# EasyEDA schematic Controlador Aforo.json

## Sheets
1 Controlador_aforo: TITLE: Sheet_1; REV: 1.0; Date: 2021-12-02; Sheet: 1/1; Drawn By: Sergio Camilo Reina Cardenas; Company: Your Company
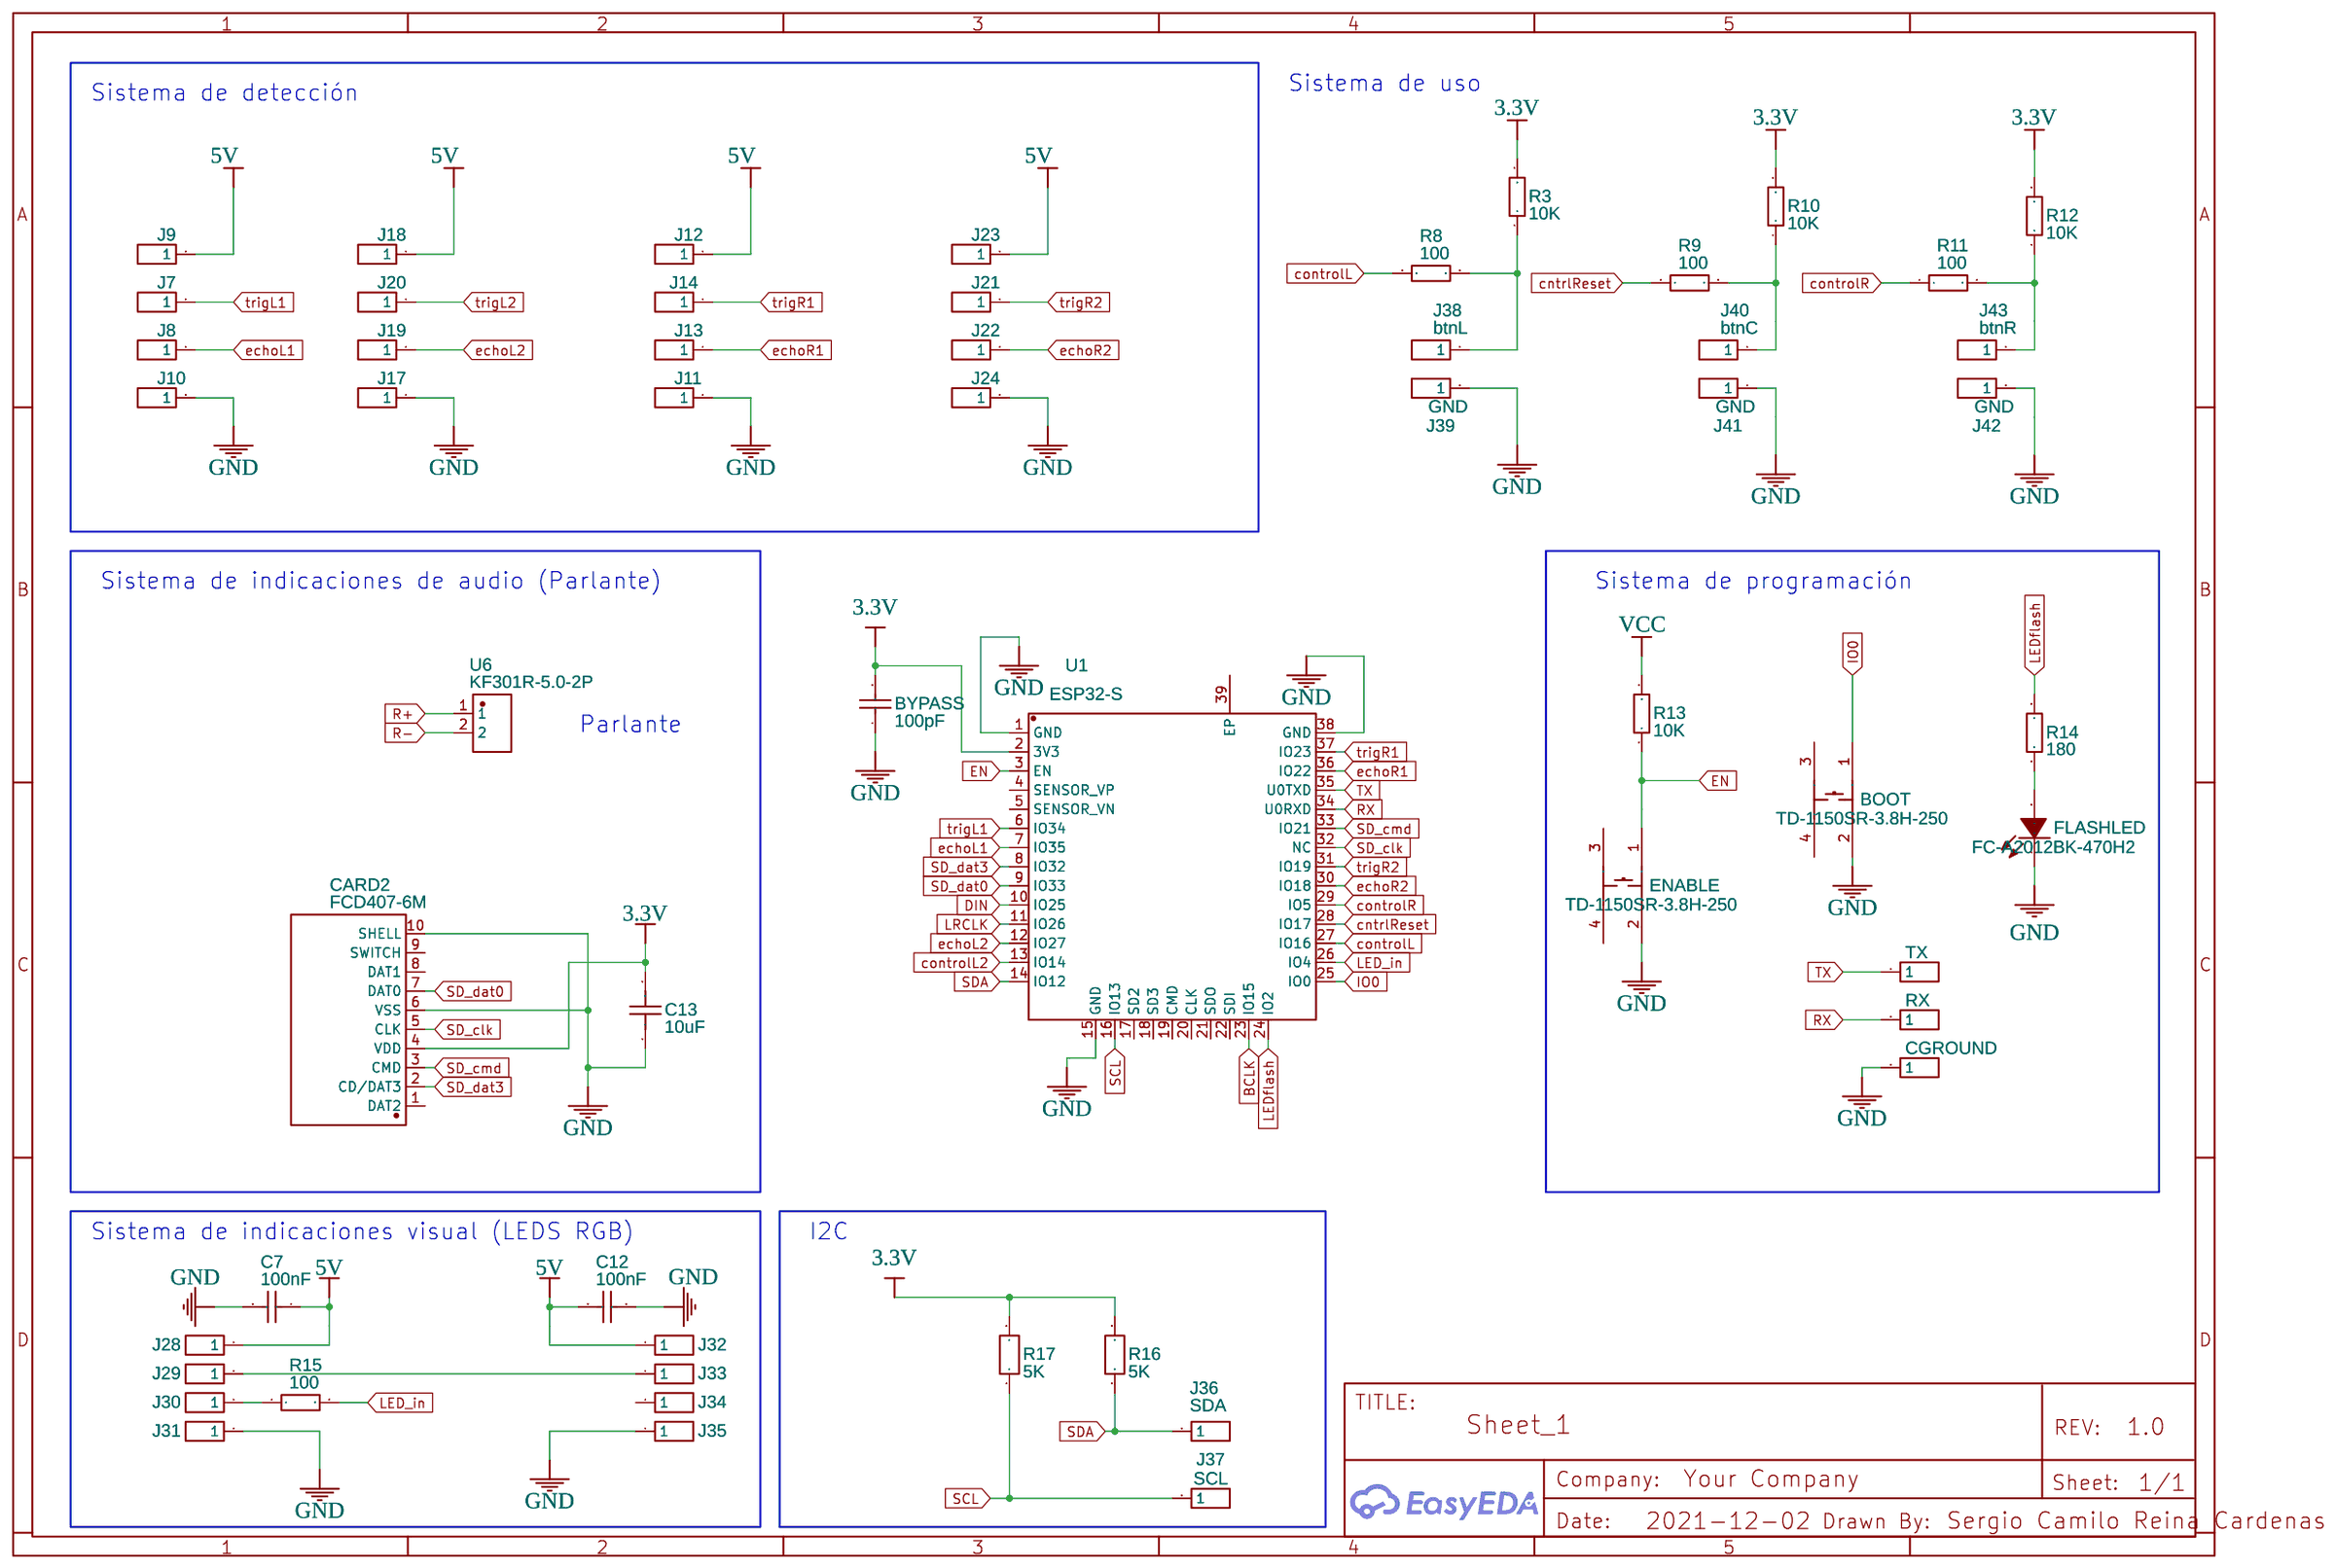
[diagram p0: Controlador_aforo]
2 Power: TITLE: Sheet_2
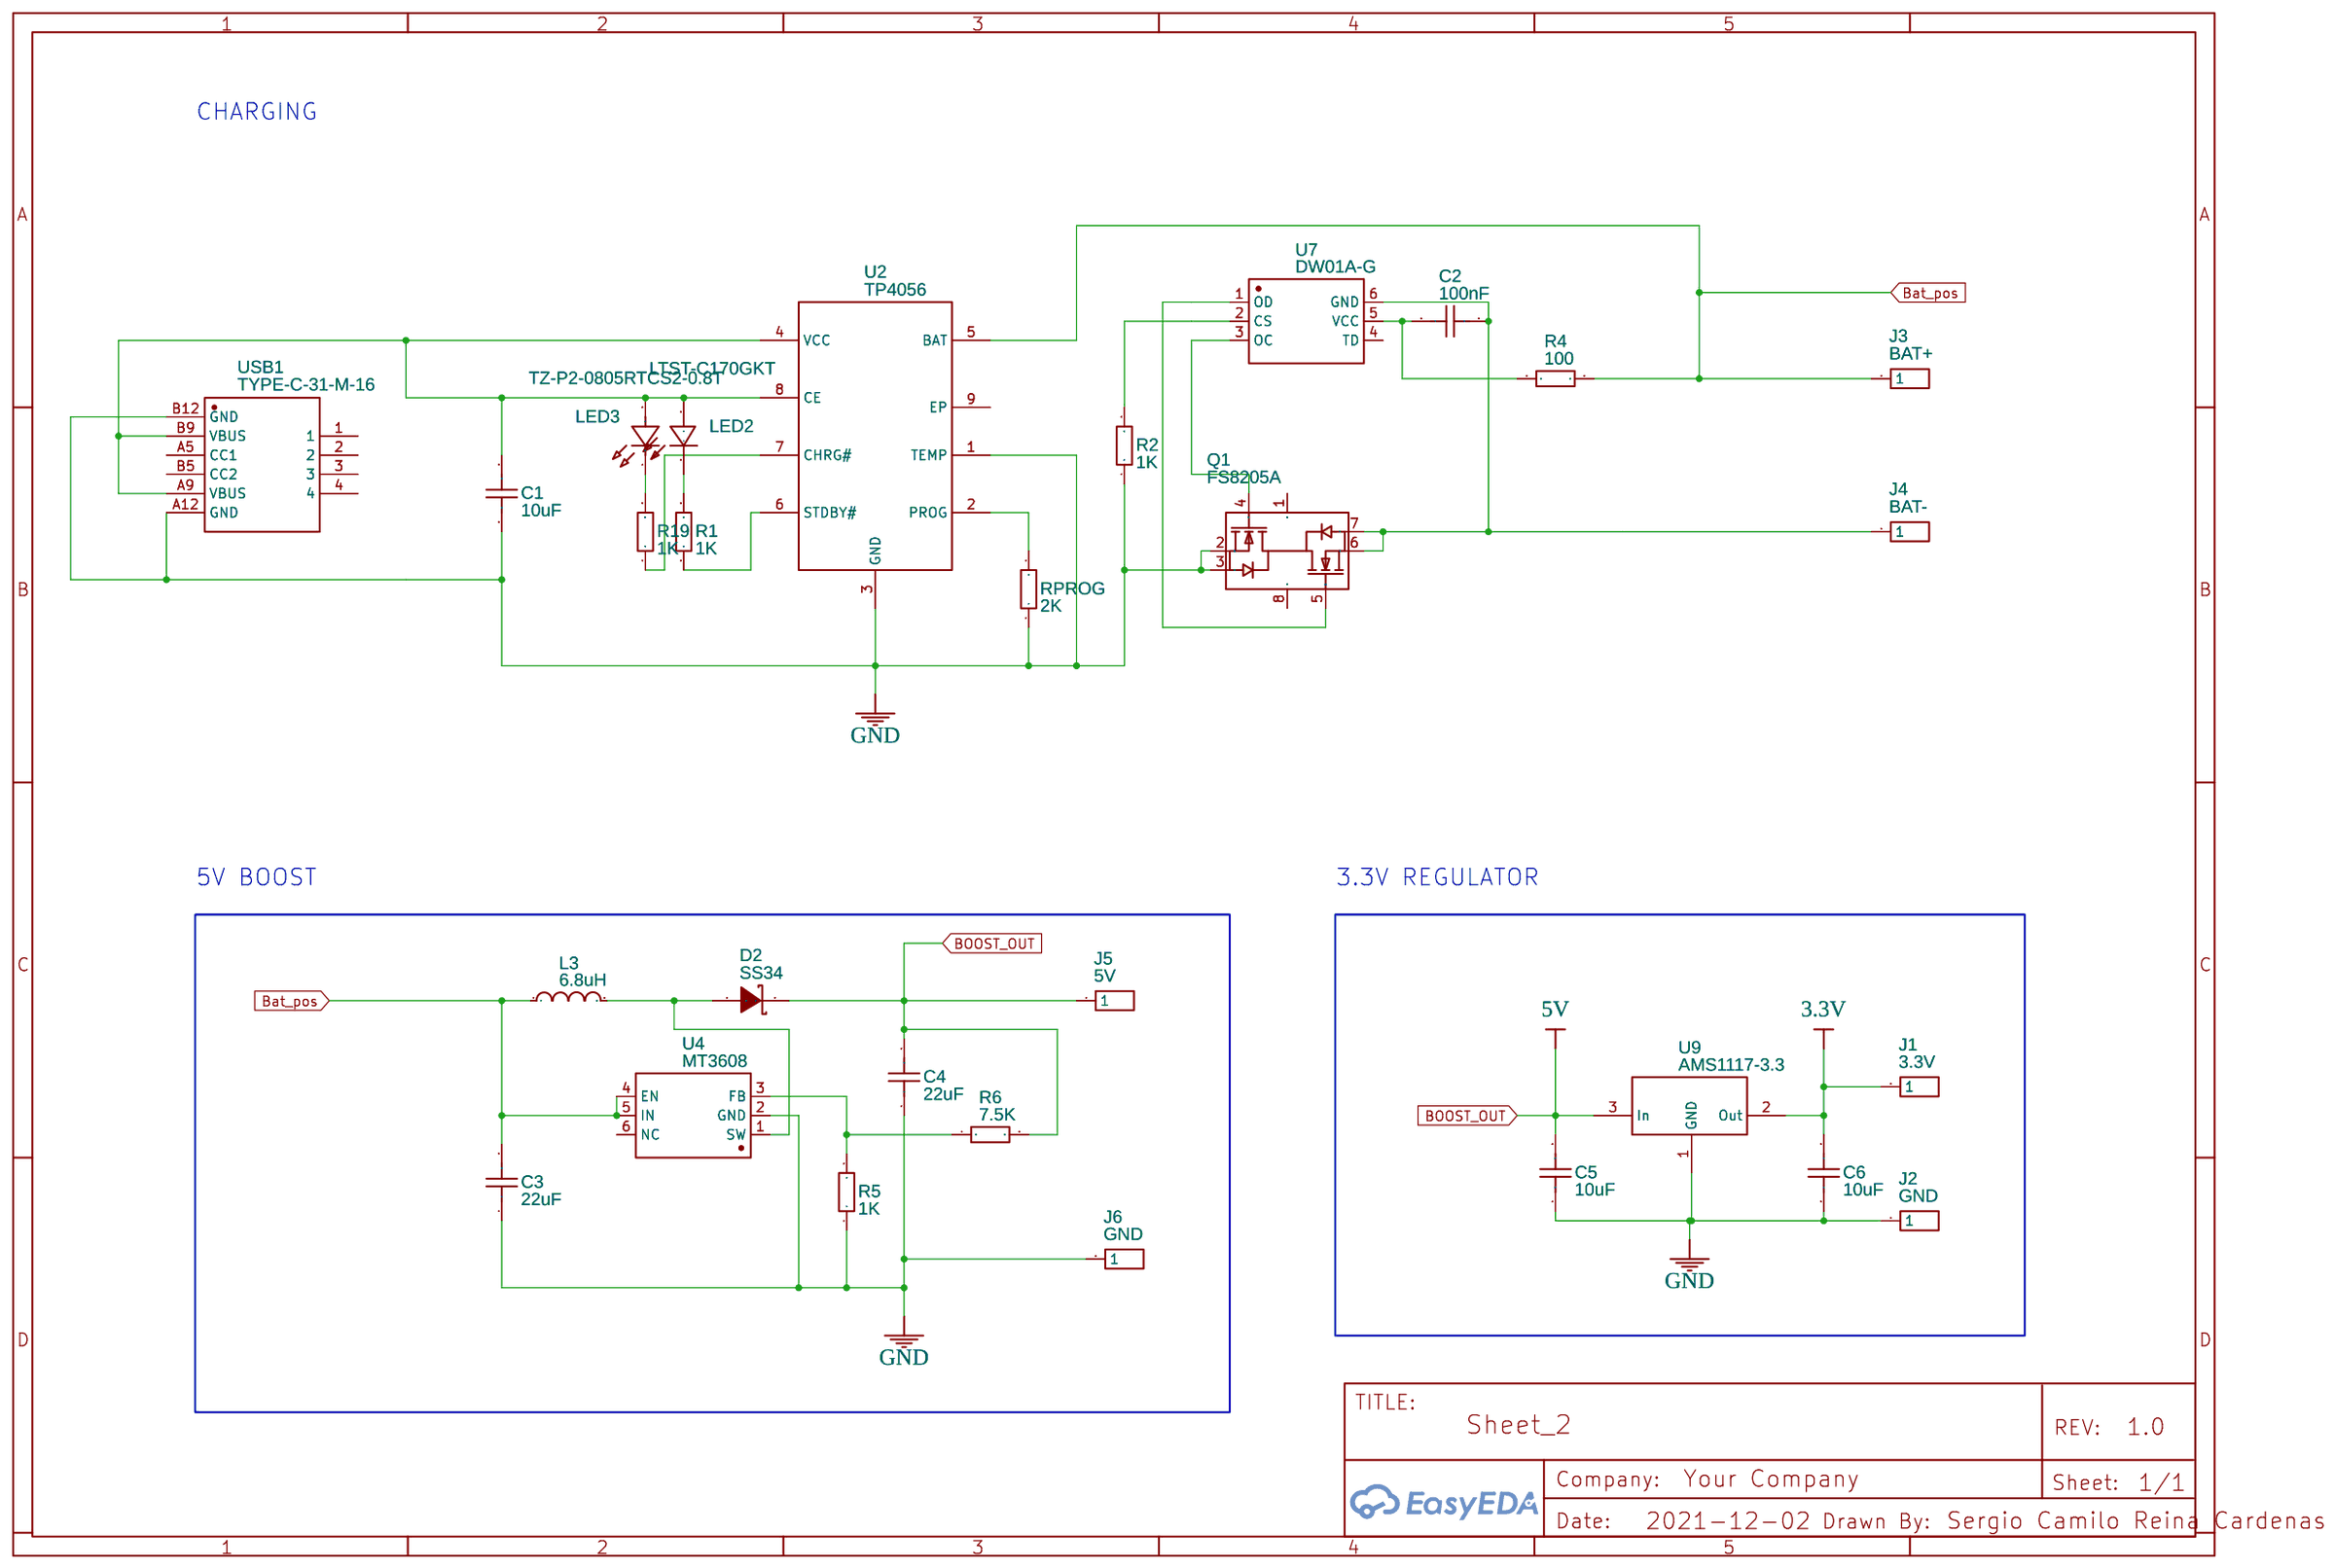
[diagram p1: Power]
3 Audio_amplifier: Date: 2021-12-14
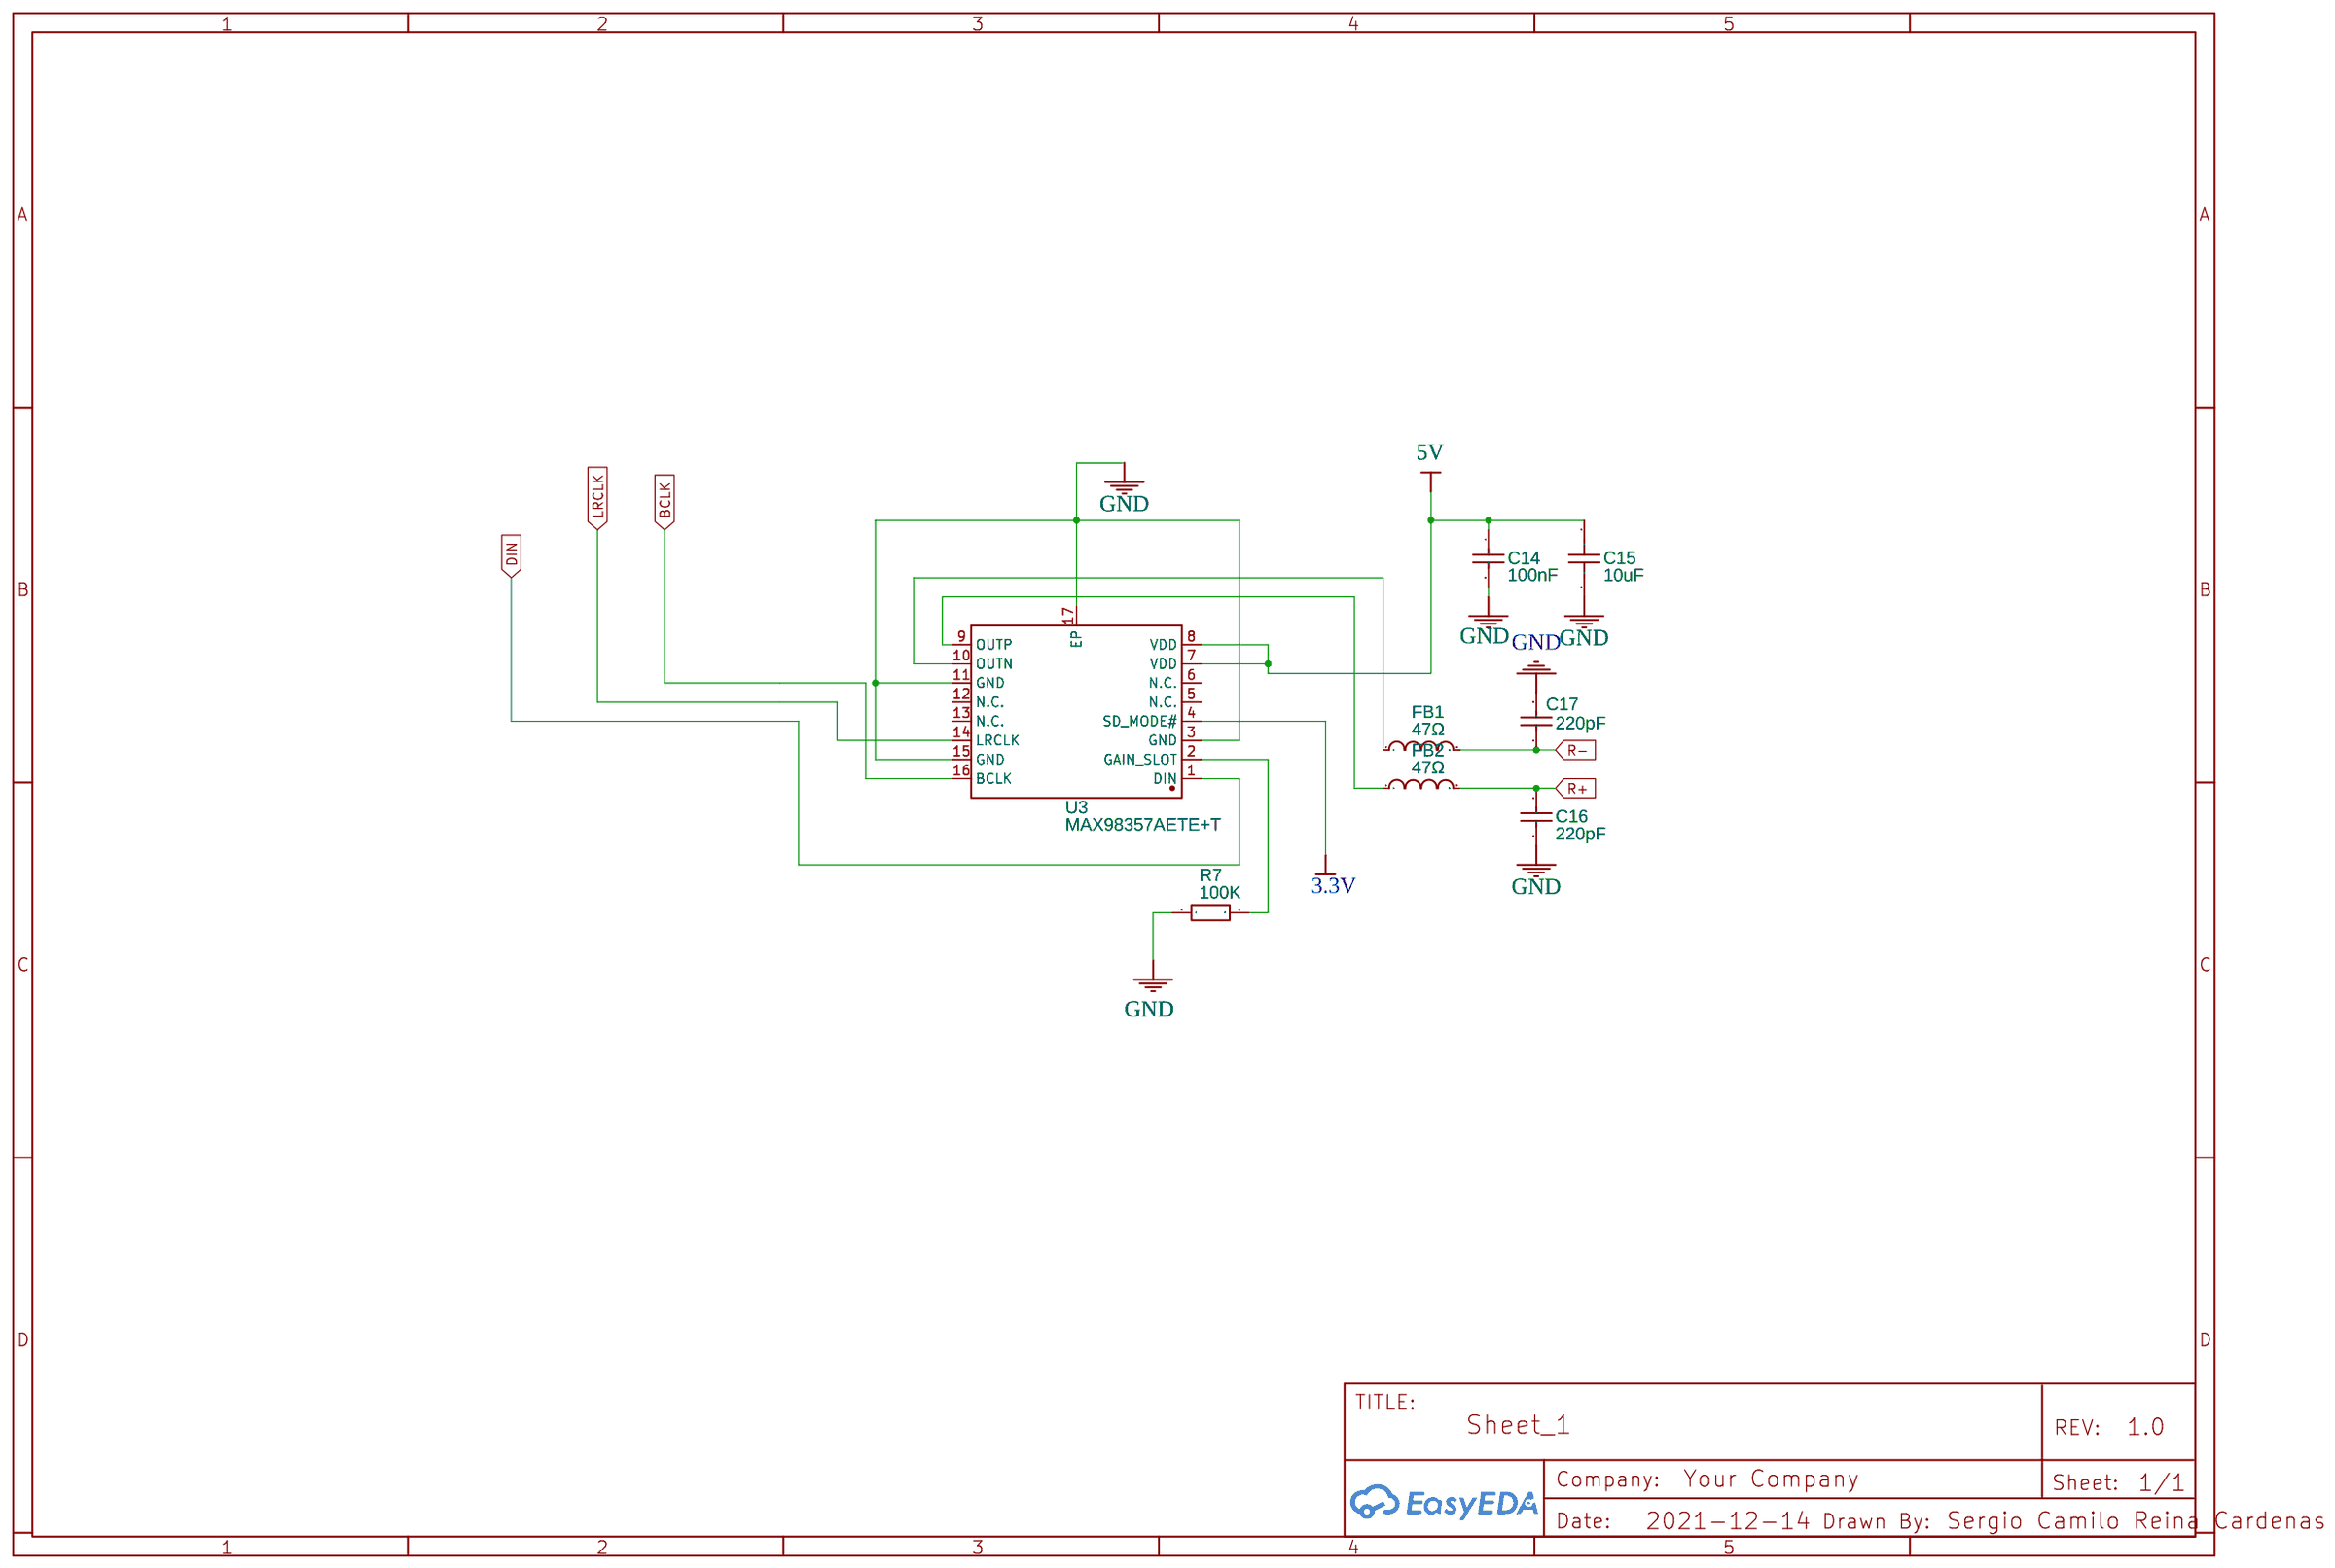
[diagram p2: Audio_amplifier]

## Parts
sheet Audio_amplifier
C14  100nF  [C1210]
C15  10uF  [C0805]
C16  220pF  [0805]
C17  220pF  [0805]
FB1  47Ω  [0805]
FB2  47Ω  [0805]
R7  100K  [R0805]
U3  MAX98357AETE+T  [TQFN-16_L3.0-W3.0-P0.50-BL-EP1.5]
sheet Controlador_aforo
BOOT  TD-1150SR-3.8H-250  [KEY-SMD_4P-L4.5-W4.5-P3.00-LS6.5]
BYPASS  100pF  [C1210]
C7  100nF  [C1210]
C12  100nF  [C1210]
C13  10uF  [C0805]
CARD2  FCD407-6M  [MICRO-SD-SMD_FCD407-6M]
CGROUND  HDR-M-2.54_1x1  [HDR-M-2.54_1X1]
ENABLE  TD-1150SR-3.8H-250  [KEY-SMD_4P-L4.5-W4.5-P3.00-LS6.5]
FLASHLED  FC-A2012BK-470H2  [LED0805-RD]
J7  HDR-M-2.54_1x1  [HDR-M-2.54_1X1]
J8  HDR-M-2.54_1x1  [HDR-M-2.54_1X1]
J9  HDR-M-2.54_1x1  [HDR-M-2.54_1X1]
J10  HDR-M-2.54_1x1  [HDR-M-2.54_1X1]
J11  HDR-M-2.54_1x1  [HDR-M-2.54_1X1]
J12  HDR-M-2.54_1x1  [HDR-M-2.54_1X1]
J13  HDR-M-2.54_1x1  [HDR-M-2.54_1X1]
J14  HDR-M-2.54_1x1  [HDR-M-2.54_1X1]
J17  HDR-M-2.54_1x1  [HDR-M-2.54_1X1]
J18  HDR-M-2.54_1x1  [HDR-M-2.54_1X1]
J19  HDR-M-2.54_1x1  [HDR-M-2.54_1X1]
J20  HDR-M-2.54_1x1  [HDR-M-2.54_1X1]
J21  HDR-M-2.54_1x1  [HDR-M-2.54_1X1]
J22  HDR-M-2.54_1x1  [HDR-M-2.54_1X1]
J23  HDR-M-2.54_1x1  [HDR-M-2.54_1X1]
J24  HDR-M-2.54_1x1  [HDR-M-2.54_1X1]
J28  HDR-M-2.54_1x1  [HDR-M-2.54_1X1]
J29  HDR-M-2.54_1x1  [HDR-M-2.54_1X1]
J30  HDR-M-2.54_1x1  [HDR-M-2.54_1X1]
J31  HDR-M-2.54_1x1  [HDR-M-2.54_1X1]
J32  HDR-M-2.54_1x1  [HDR-M-2.54_1X1]
J33  HDR-M-2.54_1x1  [HDR-M-2.54_1X1]
J34  HDR-M-2.54_1x1  [HDR-M-2.54_1X1]
J35  HDR-M-2.54_1x1  [HDR-M-2.54_1X1]
J36  SDA  [HDR-M-2.54_1X1]
J37  SCL  [HDR-M-2.54_1X1]
J38  btnL  [HDR-M-2.54_1X1]
J39  GND  [HDR-M-2.54_1X1]
J40  btnC  [HDR-M-2.54_1X1]
J41  GND  [HDR-M-2.54_1X1]
J42  GND  [HDR-M-2.54_1X1]
J43  btnR  [HDR-M-2.54_1X1]
R3  10K  [R0805]
R8  100  [R0805]
R9  100  [R0805]
R10  10K  [R0805]
R11  100  [R0805]
R12  10K  [R0805]
R13  10K  [R0805]
R14  180  [R0805]
R15  100  [R0805]
R16  5K  [R0805]
R17  5K  [R0805]
RX  HDR-M-2.54_1x1  [HDR-M-2.54_1X1]
TX  HDR-M-2.54_1x1  [HDR-M-2.54_1X1]
U1  ESP32-S  [WIRELM-SMD_ESP32-S]
U6  KF301R-5.0-2P  [CONN-TH_P5.00_KF301R-5.0-2P]
sheet Power
C1  10uF  [C0603]
C2  100nF  [C0603]
C3  22uF  [C0603]
C4  22uF  [C0603]
C5  10uF  [C0805]
C6  10uF  [C0805]
D2  SS34  [SMC_L7.1-W6.2-LS8.1-R-RD]
J1  3.3V  [HDR-M-2.54_1X1]
J2  GND  [HDR-M-2.54_1X1]
J3  BAT+  [HDR-M-2.54_1X1]
J4  BAT-  [HDR-M-2.54_1X1]
J5  5V  [HDR-M-2.54_1X1]
J6  GND  [HDR-M-2.54_1X1]
L3  6.8uH  [IND-SMD_L3.5-W3.0]
LED2  TZ-P2-0805RTCS2-0.8T  [LED0805-RD_RED]
LED3  LTST-C170GKT  [LED0805-RD_GREEN]
Q1  FS8205A  [TSSOP-8_3X4.4X065P]
R1  1K  [R0805]
R2  1K  [R0805]
R4  100  [R0805]
R5  1K  [R0805]
R6  7.5K  [R0805]
R19  1K  [R0805]
RPROG  2K  [R0805]
U2  TP4056  [ESOP-8_L4.9-W3.9-P1.27-LS6.0-BL-EP]
U4  MT3608  [SOT-23-6_L2.9-W1.6-P0.95-LS2.8-BR]
U7  DW01A-G  [SOT-23-6_L2.9-W1.6-P0.95-LS2.8-BR]
U9  AMS1117-3.3  [SOT-223]
USB1  TYPE-C-31-M-16  [TYPE-C-SMD_TYPE-C-31-M-16]

## Library data of the parts
C7 C12 C14 = C1210X104M501T: Supplier: LCSC; Manufacturer: HEC; Supplier Part: C106106; JLCPCB Part Class: Extended Part
C5 C6 C13 C15 = 0805F106M100NT: Supplier: LCSC; Manufacturer: FH; Supplier Part: C91158; JLCPCB Part Class: Extended Part
C16 C17 = CL21B221KBANNNC: Supplier: LCSC; Manufacturer: SAMSUNG; LCSC Assembly: Yes; Supplier Part: C53172; SMT Type: Basic
FB1 FB2 = BK2125HS470-T: Supplier: LCSC; Manufacturer: TAIYO YUDEN; Supplier Part: C92871
R7 = AR05BTDW1003: Supplier: LCSC; Supplier Part: C319972; Manufacturer: Viking Tech; Contributor: LCSC
U3 = MAX98357AETE+T: Supplier: LCSC; Supplier Part: C910544; Manufacturer: MAXIM(美信); Contributor: LCSC; JLCPCB Part Class: Extended Part
BOOT ENABLE = TD-1150SR-3.8H-250: Supplier: LCSC; Supplier Part: C2905105; Manufacturer: DEALON(德艺隆); Contributor: LCSC
BYPASS = C1210N101J202T: Supplier: LCSC; Manufacturer: HEC; Supplier Part: C106093; JLCPCB Part Class: Extended Part
CARD2 = FCD407-6M: Supplier: LCSC; Supplier Part: C456402; Manufacturer: TXGA(特思嘉); Contributor: LCSC; JLCPCB Part Class: Extended Part
CGROUND J1-J14 J17-J24 J28-J43 RX TX = HDR-M-2.54_1x1: Supplier Part: C81276; Supplier: LCSC; Contributor: LCEDA_Lib
FLASHLED = FC-A2012BK-470H2: Supplier: LCSC; Manufacturer: NATIONSTAR; Supplier Part: C84259; JLCPCB Part Class: Extended Part
R3 R10 R12 R13 = RMCF0805FT10K0: Supplier: LCSC; Supplier Part: C237755; Manufacturer: Stackpole Elec; Contributor: LCSC; JLCPCB Part Class: Extended Part
R4 R8 R9 R11 R15 = RMC08051001%N: Supplier: LCSC; Supplier Part: C269741; Manufacturer: Tyohm; Contributor: LCSC; JLCPCB Part Class: Extended Part
R14 = HPCR0805F180RK9: Supplier: LCSC; Supplier Part: C365251; Manufacturer: ResistorToday; Contributor: LCSC
R16 R17 = RTT055001FTP: Supplier: LCSC; Supplier Part: C332873; Manufacturer: RALEC; Contributor: LCSC
U1 = ESP32-S: Supplier: LCSC; Supplier Part: C277944; Manufacturer: Ai-Thinker; Contributor: LCSC; JLCPCB Part Class: Extended Part
U6 = KF301R-5.0-2P: Supplier: LCSC; Supplier Part: C474883; Manufacturer: Cixi Kefa Elec; Contributor: LCSC; JLCPCB Part Class: Extended Part
C1-C4 = CS1608X7R225K100NRB: Supplier: LCSC; Supplier Part: C516003; Manufacturer: Samwha Capacitor; Contributor: LCSC
D2 = SS34: Supplier: LCSC; Manufacturer: MDD; Supplier Part: C13763; JLCPCB Part Class: Extended Part
L3 = SCCD32-6R8MT: Supplier: LCSC; Supplier Part: C532852; Manufacturer: Yanchuang; Contributor: LCSC; JLCPCB Part Class: Extended Part
LED2 = TZ-P2-0805RTCS2-0.8T: Supplier: LCSC; Supplier Part: C688884; Manufacturer: TUOZHAN; Contributor: LCSC; JLCPCB Part Class: Extended Part
LED3 = LTST-C170GKT: Supplier: LCSC; Supplier Part: C125090; Manufacturer: Lite-On; Contributor: LCSC; JLCPCB Part Class: Extended Part
Q1 = FS8205A: Supplier: LCSC; Manufacturer: FORTUNE; LCSC Assembly: Yes; image: //image.lceda.cn/szlcsc/C16052.jpg; Supplier Part: C16052; Contributor: alehramanovich
R1 R2 R5 R19 = CR0805J80102G: Supplier: LCSC; Supplier Part: C101925; Manufacturer: LIZ Elec; Contributor: LCSC; JLCPCB Part Class: Extended Part
R6 = RMCF0805JT7K50: Supplier: LCSC; Supplier Part: C237142; Manufacturer: Stackpole Elec; Contributor: LCSC; JLCPCB Part Class: Extended Part
RPROG = CR0805J80202G: Supplier: LCSC; Manufacturer: LIZ; Supplier Part: C101963; JLCPCB Part Class: Extended Part
U2 = TP4056: Contributor: Guest; Supplier: LCSC; Manufacturer: TOPPOWER; Supplier Part: C16581; JLCPCB Part Class: Basic Part
U4 = MT3608: Supplier: LCSC; Manufacturer: AEROSEMI; Supplier Part: C84817; JLCPCB Part Class: Extended Part
U7 = DW01A-G: Supplier: LCSC; Manufacturer: FORTUNE; Contributor: LCSC; Supplier Part: C61503; JLCPCB Part Class: Extended Part
U9 = -: sourceId: dwIGgezVh; Supplier: LCSC; Manufacturer: AMS; LCSC Assembly: Yes; image: //image.lceda.cn/szlcsc/C6186.jpg; Contributor: jobsonp; Supplier Part: C6186
USB1 = TYPE-C-31-M-16: Supplier: LCSC; Supplier Part: C283541; Manufacturer: Korean Hroparts Elec; Contributor: LCSC; JLCPCB Part Class: Extended Part

## Nets
3.3V: BYPASS.2 C6.2 C13.2 CARD2.4(VDD) J1.1 R3.2 R10.2 R12.2 R16.2 R17.2 U1.2(3V3) U3.4(SD_MODE#) U9.2(Out)
5V: C4.2 C5.2 C7.1 C12.2 C14.1 C15.2 D2.2(K) J5.1 J9.1 J12.1 J18.1 J23.1 J28.1 J32.1 R6.2 U3.7(VDD) U3.8(VDD) U9.3(In)
GND: BOOT.2 BYPASS.1 C1.1 C3.1 C4.1 C5.1 C6.1 C7.2 C12.1 C13.1 C14.2 C15.1 C16.1 C17.2 CARD2.6(VSS) CARD2.10(SHELL) CGROUND.1 ENABLE.2 FLASHLED.1(-) J2.1 J6.1 J10.1 J11.1 J17.1 J24.1 J31.1 J35.1 J39.1 J41.1 J42.1 Q1.2(S1) Q1.3(S1) R2.1 R5.1 R7.1 RPROG.1 U1.1(GND) U1.15(GND) U1.38(GND) U2.1(TEMP) U2.3(GND) U3.3(GND) U3.11(GND) U3.15(GND) U3.17(EP) U4.2(GND) U9.1(GND) USB1.A12(GND) USB1.B12(GND)
VCC: R13.2
Bat_pos: C3.2 J3.1 L3.1 R4.2 U2.5(BAT) U4.4(EN) U4.5(IN)
BCLK: U1.23(IO15) U3.16(BCLK)
cntrlReset: R9.1 U1.28(IO17)
controlL: R8.1 U1.27(IO16)
controlL2: U1.13(IO14)
controlR: R11.1 U1.29(IO5)
DIN: U1.10(IO25) U3.1(DIN)
echoL1: J8.1 U1.7(IO35)
echoL2: J19.1 U1.12(IO27)
echoR1: J13.1 U1.36(IO22)
echoR2: J22.1 U1.30(IO18)
EN: ENABLE.1 R13.1 U1.3(EN)
IO0: BOOT.1 U1.25(IO0)
LED_in: R15.2 U1.26(IO4)
LEDflash: R14.2 U1.24(IO2)
LRCLK: U1.11(IO26) U3.14(LRCLK)
R+: C16.2 FB2.2 U6.1
R-: C17.1 FB1.2 U6.2
RX: RX.1 U1.34(U0RXD)
SCL: J37.1 R17.1 U1.16(IO13)
SD_clk: CARD2.5(CLK) U1.32(NC)
SD_cmd: CARD2.3(CMD) U1.33(IO21)
SD_dat0: CARD2.7(DAT0) U1.9(IO33)
SD_dat3: CARD2.2(CD/DAT3) U1.8(IO32)
SDA: J36.1 R16.1 U1.14(IO12)
trigL1: J7.1 U1.6(IO34)
trigL2: J20.1
trigR1: J14.1 U1.37(IO23)
trigR2: J21.1 U1.31(IO19)
TX: TX.1 U1.35(U0TXD)
Net-(C1-2): C1.2 LED2.2(A) LED3.2(+) U2.4(VCC) U2.8(CE) USB1.A9(VBUS) USB1.B9(VBUS)
Net-(C2-1): C2.1 J4.1 Q1.6(S2) Q1.7(S2) U7.6(GND)
Net-(C2-2): C2.2 R4.1 U7.5(VCC)
Net-(D2-1): D2.1(A) L3.2 U4.1(SW)
Net-(FB1-1): FB1.1 U3.10(OUTN)
Net-(FB2-1): FB2.1 U3.9(OUTP)
Net-(FLASHLED-2): FLASHLED.2(+) R14.1
Net-(J29-1): J29.1 J33.1
Net-(J30-1): J30.1 R15.1
Net-(J38-1): J38.1 R3.1 R8.2
Net-(J40-1): J40.1 R9.2 R10.1
Net-(J43-1): J43.1 R11.2 R12.1
Net-(LED2-1): LED2.1(K) R19.2
Net-(LED3-1): LED3.1(-) R1.2
Net-(Q1-4): Q1.4(G1) U7.3(OC)
Net-(Q1-5): Q1.5(G2) U7.1(OD)
Net-(R1-1): R1.1 U2.6(STDBY#)
Net-(R2-2): R2.2 U7.2(CS)
Net-(R5-2): R5.2 R6.1 U4.3(FB)
Net-(R7-2): R7.2 U3.2(GAIN_SLOT)
Net-(R19-1): R19.1 U2.7(CHRG#)
Net-(RPROG-2): RPROG.2 U2.2(PROG)

Not connected (* = marked no-connect by the designer): BOOT 3 4; CARD2 1(DAT2) 8(DAT1) 9(SWITCH); ENABLE 3 4; J34 1; Q1 1(D12) 8(D12); U1 4(SENSOR_VP) 5(SENSOR_VN) 17(SD2) 18(SD3) 19(CMD) 20(CLK) 21(SDO) 22(SDI) 39(EP); U2 9(EP); U3 5(N.C.) 6(N.C.) 12(N.C.) 13(N.C.); U4 6(NC); U7 4(TD); USB1 1 2 3 4 A5(CC1) B5(CC2)

## Notes on the sheets
sheet 1
- Sistema de detección
- Sistema de uso
- Sistema de indicaciones de audio (Parlante)
- Sistema de programación
- Parlante
- Sistema de indicaciones visual (LEDS RGB)
- I2C
sheet 2
- CHARGING
- 5V BOOST
- 3.3V REGULATOR
